# Altium schematic sheet Adapter_Card_Connector.SchDoc
size A4; PageSetup: Record=PageOptions|CenterHorizontal=True|CenterVertical=True|PrintScale=0.92|XCorrection=1.00|YCorrection=1.00|PrintKind=0|BorderSize=5000000|LeftOffset=0|BottomOffset=0|Orientation=2|PaperLength=1000|PaperWidth=1000|Scale=100|PaperSource=7|PrintQuality=-4|MediaType=1|DitherType=10|PrintScaleMode=1|PaperKind=A4; CompanyName: Technische Hochschule Nürnberg Georg Simon Ohm; Organization: UltraZohm; Address1: Kesslerplatz 12; Address2: 90489 Nürnberg; Address3: GERMANY; DocumentNumber: 2; SheetNumber: 2; SheetTotal: 5; Website: www.ultrazohm.com
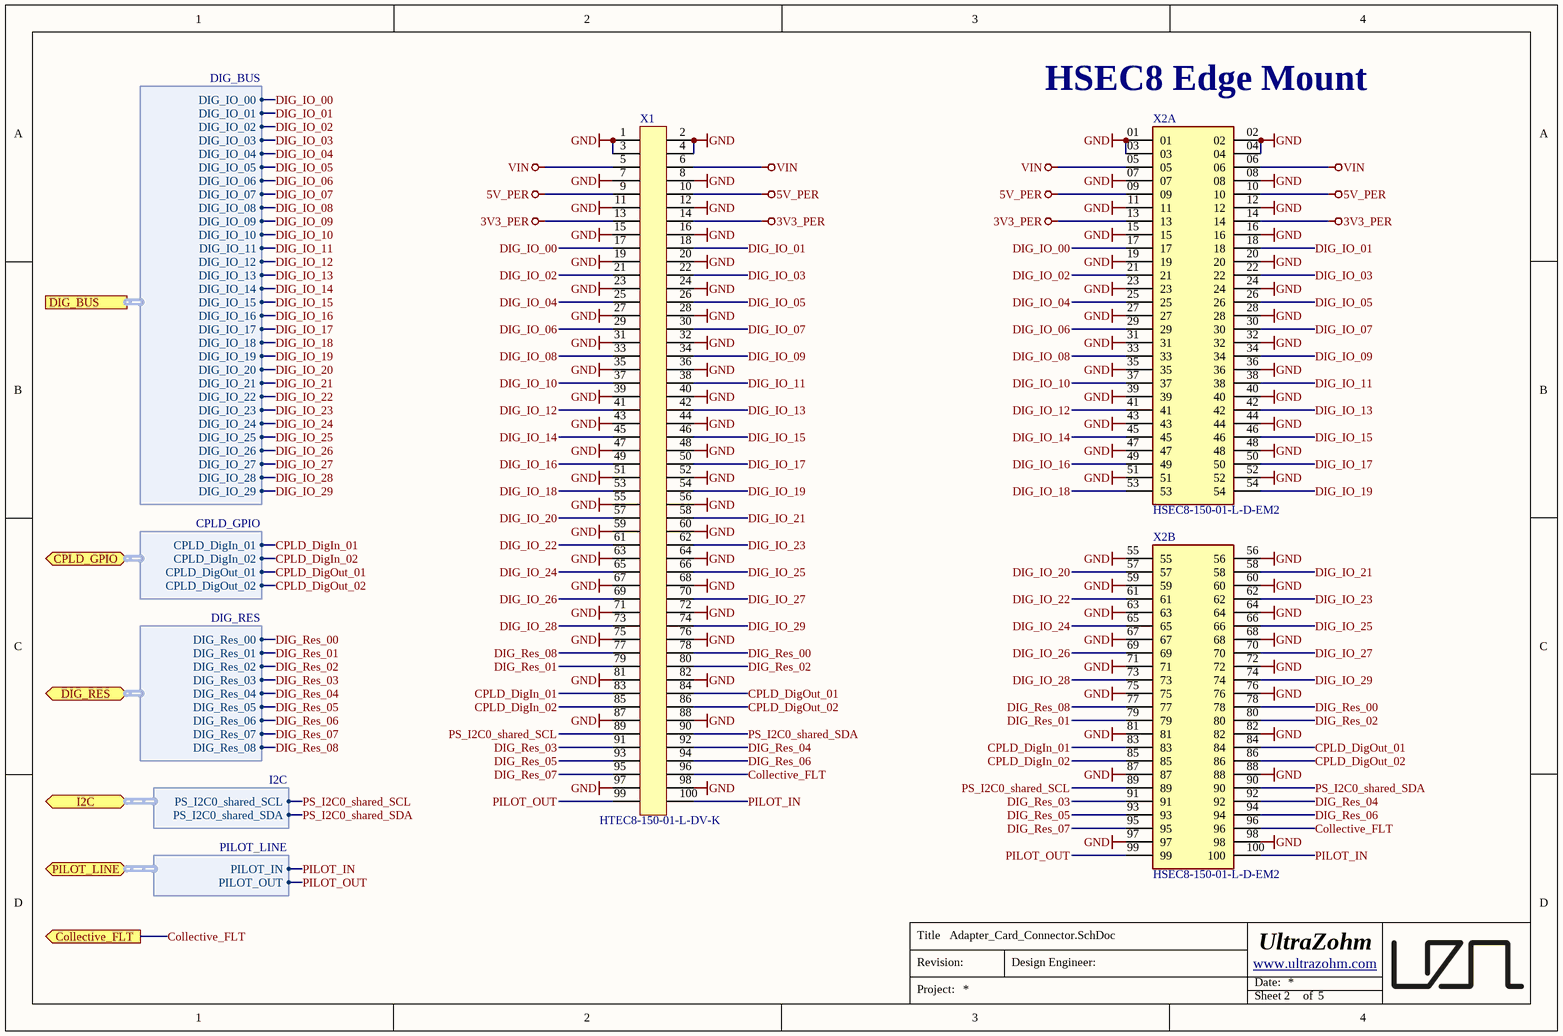
[diagram p0: Adapter_Card_Connector.SchDoc]

## Parts
X1  HTEC8-150-01-L-DV-K  [HTEC8-150-XX-X-DV]
X2  HSEC8-150-01-L-D-EM2  [HSEC8-150-01-L-D-EM2]  (parts A,B of 2)

## Ports
Collective_FLT (out), CPLD_GPIO (bidir, harness CPLD_GPIO), DIG_BUS (harness DIG_BUS), DIG_RES (bidir, harness DIG_RES), I2C (bidir, harness I2C), PILOT_LINE (bidir, harness PILOT_LINE)

## Harnesses
DIG_BUS: DIG_IO_01, DIG_IO_02, DIG_IO_03, DIG_IO_04, DIG_IO_05, DIG_IO_06, DIG_IO_07, DIG_IO_08, DIG_IO_09, DIG_IO_10, DIG_IO_11, DIG_IO_12, DIG_IO_13, DIG_IO_14, DIG_IO_15, DIG_IO_16, DIG_IO_17, DIG_IO_18, DIG_IO_19, DIG_IO_20, DIG_IO_21, DIG_IO_22, DIG_IO_23, DIG_IO_24, DIG_IO_25, DIG_IO_26, DIG_IO_27, DIG_IO_28, DIG_IO_29, DIG_IO_00
CPLD_GPIO: CPLD_DigIn_01, CPLD_DigOut_01, CPLD_DigIn_02, CPLD_DigOut_02
DIG_RES: DIG_Res_00, DIG_Res_08, DIG_Res_01, DIG_Res_02, DIG_Res_03, DIG_Res_04, DIG_Res_05, DIG_Res_06, DIG_Res_07
I2C: PS_I2C0_shared_SDA, PS_I2C0_shared_SCL
PILOT_LINE: PILOT_OUT, PILOT_IN

## Nets
3V3_PER: X1.13 X1.14 X2.13 X2.14
5V_PER: X1.9 X1.10 X2.09 X2.10
GND: X1.1 X1.2 X1.3 X1.4 X1.7 X1.8 X1.11 X1.12 X1.15 X1.16 X1.19 X1.20 X1.23 X1.24 X1.27 X1.28 X1.31 X1.32 X1.35 X1.36 X1.39 X1.40 X1.43 X1.44 X1.47 X1.48 X1.51 X1.52 X1.55 X1.56 X1.59 X1.60 X1.63 X1.64 X1.67 X1.68 X1.71 X1.72 X1.75 X1.76 X1.81 X1.82 X1.87 X1.88 X1.97 X1.98 X2.01 X2.02 X2.03 X2.04 X2.07 X2.08 X2.11 X2.12 X2.15 X2.16 X2.19 X2.20 X2.23 X2.24 X2.27 X2.28 X2.31 X2.32 X2.35 X2.36 X2.39 X2.40 X2.43 X2.44 X2.47 X2.48 X2.51 X2.52 X2.55 X2.56 X2.59 X2.60 X2.63 X2.64 X2.67 X2.68 X2.71 X2.72 X2.75 X2.76 X2.81 X2.82 X2.87 X2.88 X2.97 X2.98
VIN: X1.5 X1.6 X2.05 X2.06
Collective_FLT: X1.96 X2.96 ; port Collective_FLT
CPLD_DigIn_01: X1.83 X2.83 ; port CPLD_GPIO.CPLD_DigIn_01
CPLD_DigIn_02: X1.85 X2.85 ; port CPLD_GPIO.CPLD_DigIn_02
CPLD_DigOut_01: X1.84 X2.84 ; port CPLD_GPIO.CPLD_DigOut_01
CPLD_DigOut_02: X1.86 X2.86 ; port CPLD_GPIO.CPLD_DigOut_02
DIG_IO_00: X1.17 X2.17 ; port DIG_BUS.DIG_IO_00
DIG_IO_01: X1.18 X2.18 ; port DIG_BUS.DIG_IO_01
DIG_IO_02: X1.21 X2.21 ; port DIG_BUS.DIG_IO_02
DIG_IO_03: X1.22 X2.22 ; port DIG_BUS.DIG_IO_03
DIG_IO_04: X1.25 X2.25 ; port DIG_BUS.DIG_IO_04
DIG_IO_05: X1.26 X2.26 ; port DIG_BUS.DIG_IO_05
DIG_IO_06: X1.29 X2.29 ; port DIG_BUS.DIG_IO_06
DIG_IO_07: X1.30 X2.30 ; port DIG_BUS.DIG_IO_07
DIG_IO_08: X1.33 X2.33 ; port DIG_BUS.DIG_IO_08
DIG_IO_09: X1.34 X2.34 ; port DIG_BUS.DIG_IO_09
DIG_IO_10: X1.37 X2.37 ; port DIG_BUS.DIG_IO_10
DIG_IO_11: X1.38 X2.38 ; port DIG_BUS.DIG_IO_11
DIG_IO_12: X1.41 X2.41 ; port DIG_BUS.DIG_IO_12
DIG_IO_13: X1.42 X2.42 ; port DIG_BUS.DIG_IO_13
DIG_IO_14: X1.45 X2.45 ; port DIG_BUS.DIG_IO_14
DIG_IO_15: X1.46 X2.46 ; port DIG_BUS.DIG_IO_15
DIG_IO_16: X1.49 X2.49 ; port DIG_BUS.DIG_IO_16
DIG_IO_17: X1.50 X2.50 ; port DIG_BUS.DIG_IO_17
DIG_IO_18: X1.53 X2.53 ; port DIG_BUS.DIG_IO_18
DIG_IO_19: X1.54 X2.54 ; port DIG_BUS.DIG_IO_19
DIG_IO_20: X1.57 X2.57 ; port DIG_BUS.DIG_IO_20
DIG_IO_21: X1.58 X2.58 ; port DIG_BUS.DIG_IO_21
DIG_IO_22: X1.61 X2.61 ; port DIG_BUS.DIG_IO_22
DIG_IO_23: X1.62 X2.62 ; port DIG_BUS.DIG_IO_23
DIG_IO_24: X1.65 X2.65 ; port DIG_BUS.DIG_IO_24
DIG_IO_25: X1.66 X2.66 ; port DIG_BUS.DIG_IO_25
DIG_IO_26: X1.69 X2.69 ; port DIG_BUS.DIG_IO_26
DIG_IO_27: X1.70 X2.70 ; port DIG_BUS.DIG_IO_27
DIG_IO_28: X1.73 X2.73 ; port DIG_BUS.DIG_IO_28
DIG_IO_29: X1.74 X2.74 ; port DIG_BUS.DIG_IO_29
DIG_Res_00: X1.78 X2.78 ; port DIG_RES.DIG_Res_00
DIG_Res_01: X1.79 X2.79 ; port DIG_RES.DIG_Res_01
DIG_Res_02: X1.80 X2.80 ; port DIG_RES.DIG_Res_02
DIG_Res_03: X1.91 X2.91 ; port DIG_RES.DIG_Res_03
DIG_Res_04: X1.92 X2.92 ; port DIG_RES.DIG_Res_04
DIG_Res_05: X1.93 X2.93 ; port DIG_RES.DIG_Res_05
DIG_Res_06: X1.94 X2.94 ; port DIG_RES.DIG_Res_06
DIG_Res_07: X1.95 X2.95 ; port DIG_RES.DIG_Res_07
DIG_Res_08: X1.77 X2.77 ; port DIG_RES.DIG_Res_08
PILOT_IN: X1.100 X2.100 ; port PILOT_LINE.PILOT_IN
PILOT_OUT: X1.99 X2.99 ; port PILOT_LINE.PILOT_OUT
PS_I2C0_shared_SCL: X1.89 X2.89 ; port I2C.PS_I2C0_shared_SCL
PS_I2C0_shared_SDA: X1.90 X2.90 ; port I2C.PS_I2C0_shared_SDA

## Notes on the sheet
- (near X2) HSEC8 Edge Mount
- Title
- Revision:
- Design Engineer:
- Date:
- Project:
- Sheet
- of

## Library data of the parts
X1 = 30757: AN: 30757; Mixed: SMT; Temperature-Range: -55/+125; Extra: Samtec 0.80 mm High-Speed Edge Card Connector, 100pin 10µ Plating; Case: HTEC8; HelpURL: b:\AD\adlib\datasheet\Samtec\HTEC8\; H-ART: HTEC8-150-01-L-DV-K
X2 = HSEC8-150-01-L-D-EM2: 100 Position Female Connector Non Specified - Dual Edge Gold 0.031" (0.80mm) Black; MF: Samtec; Value: HSEC8-150-01-L-D-EM2; MPN: HSEC8-150-01-L-D-EM2; Created: 2021_03_24_AGeiger